# EasyEDA schematic SCH_catvalve.json
TITLE: valve; REV: 1.0; Date: 2024-05-08; Sheet: 1/1; Drawn By: yinsu0_o; Company: Yinsu
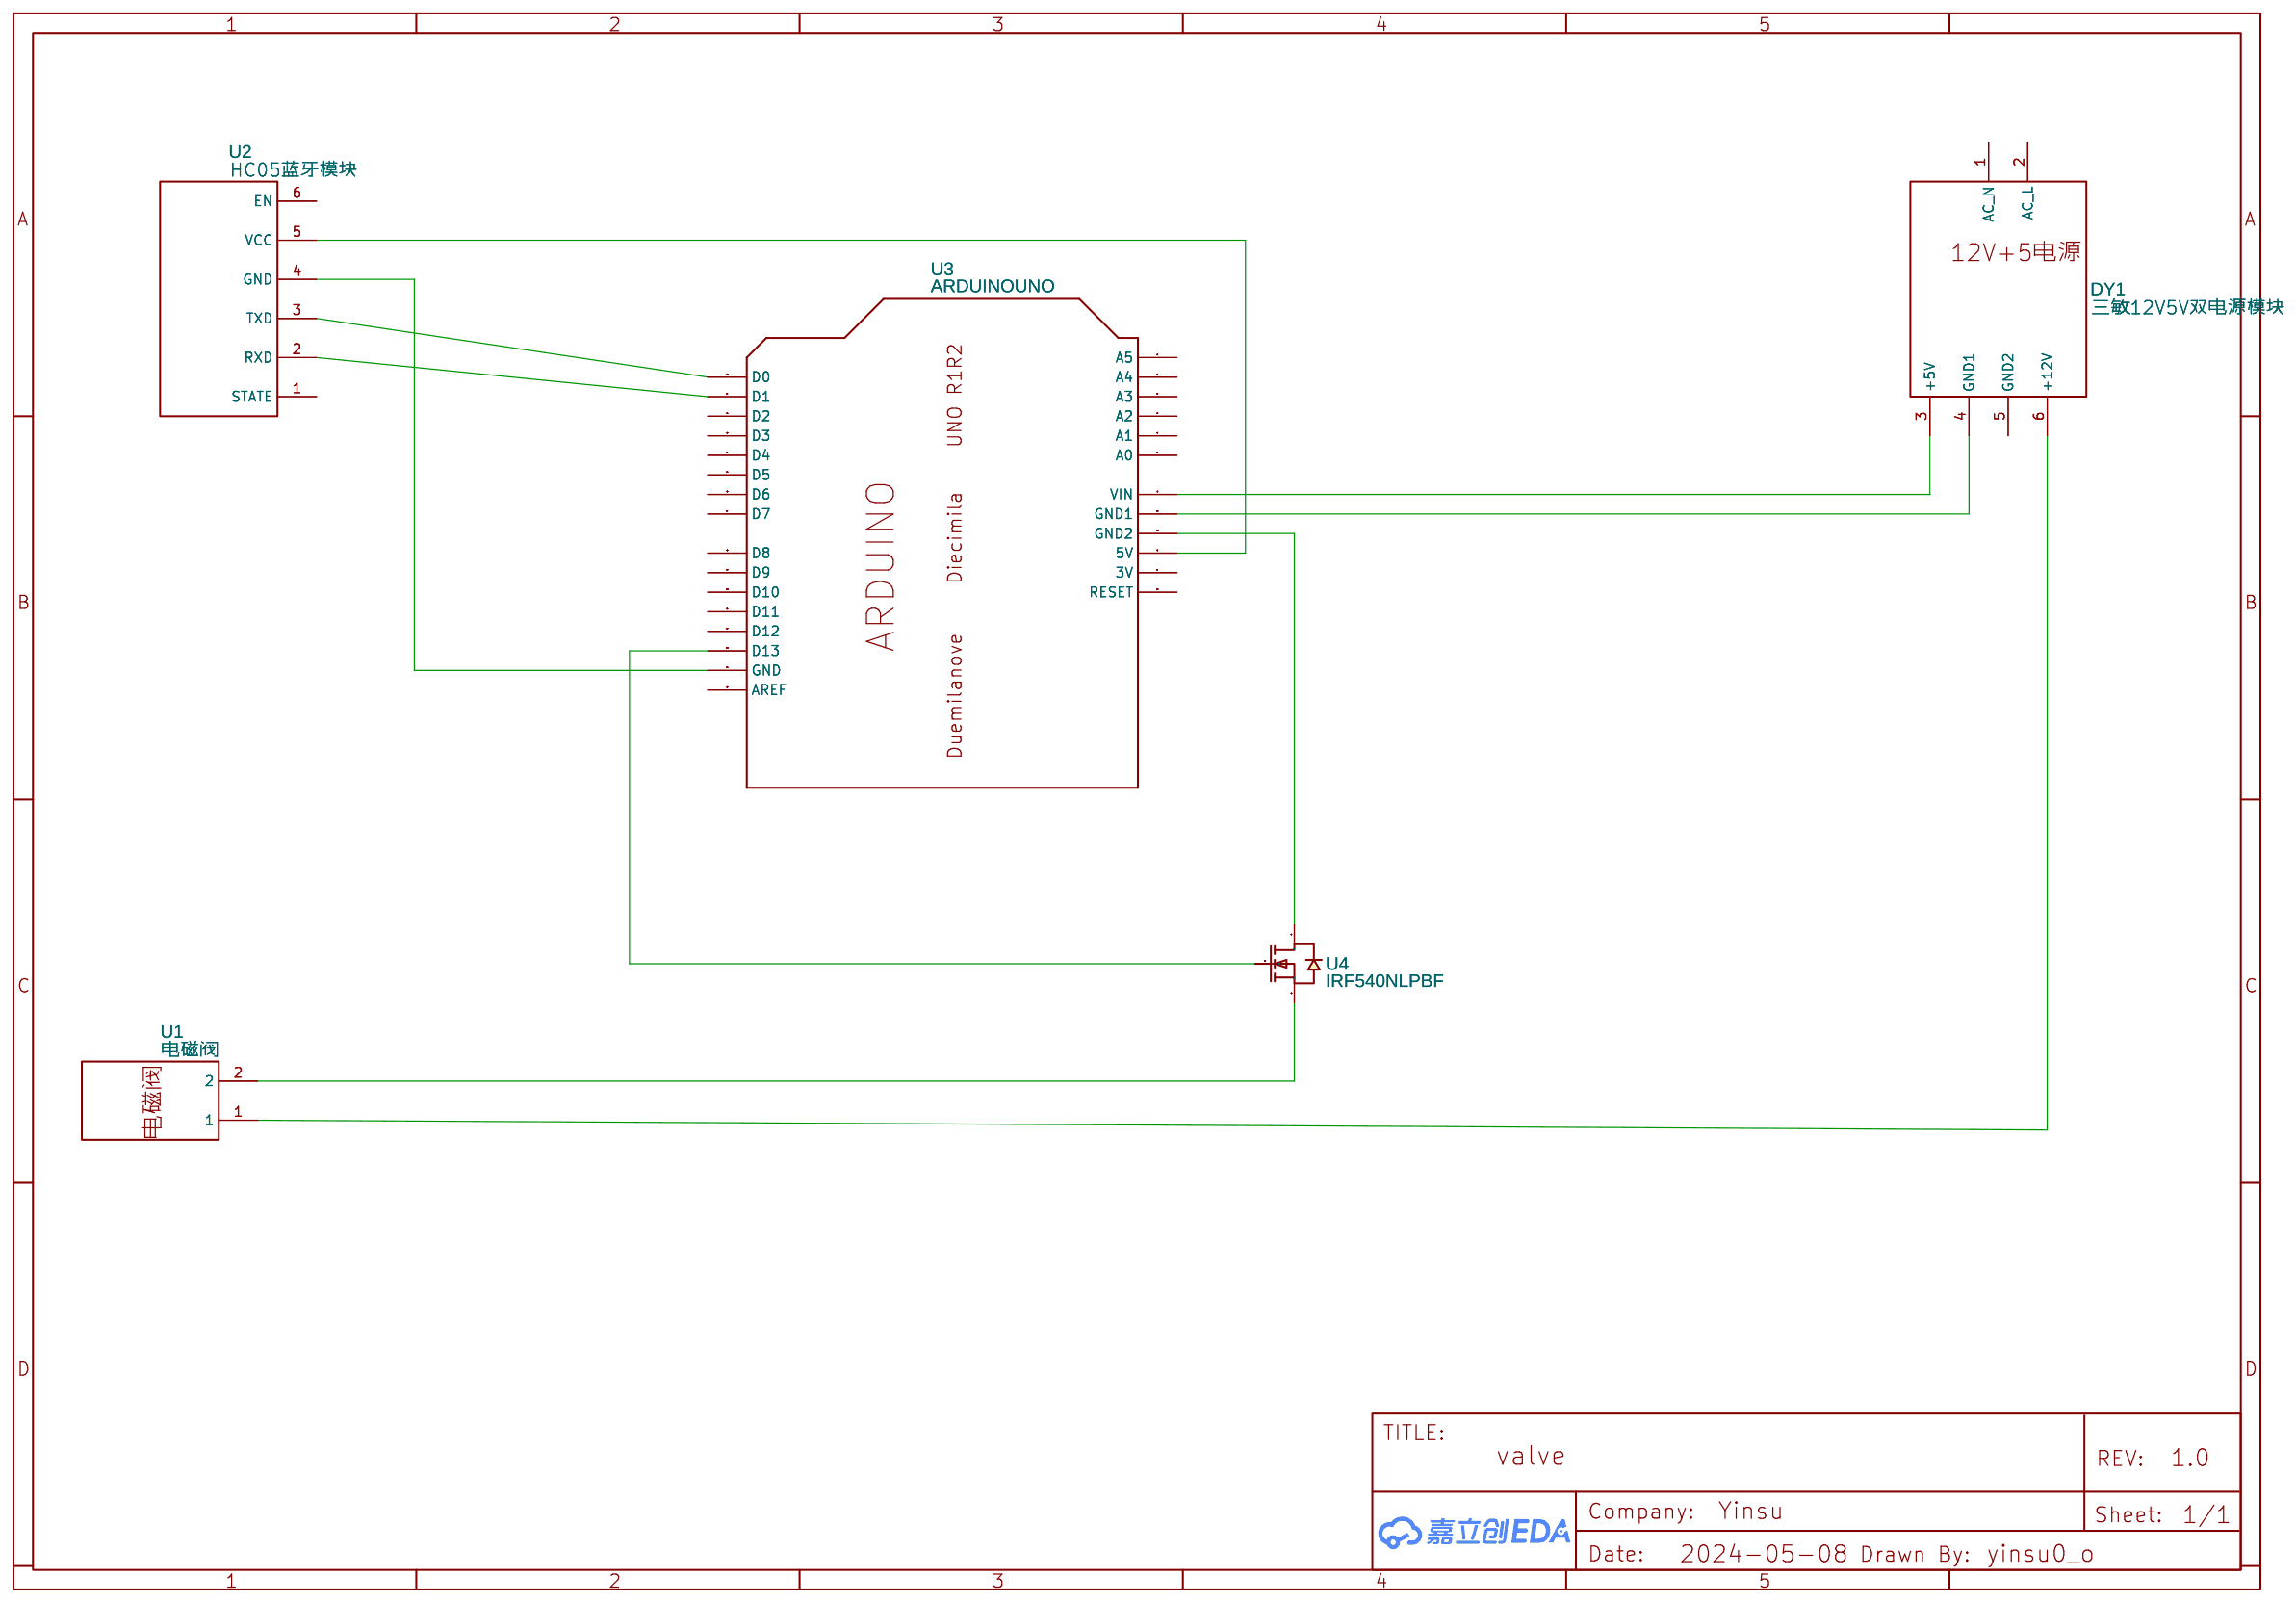
[diagram p0: schematic sheet]

## Parts
DY1  三敏12V5V双电源模块  [三敏12V5V双输出电源]
U1  电磁阀  [电磁阀]
U2  HC05蓝牙模块  [HC05]
U3  ARDUINOUNO  [ARDUINO]
U4  IRF540NLPBF  [TO-262-3_L10.2-W4.6-P2.54-L]

## Library data of the parts
DY1 = 三敏12V5V双电源模块: Contributor: zhaoji
U1 = 电磁阀
U2 = HC05: Contributor: h1253879361
U3 = ARDUINOUNO: Arduino DiecimilaDuemilanove; Contributor: yangdingding
U4 = IRF540NLPBF: Contributor: lcsc; Supplier: LCSC; Supplier Part: C459969; Manufacturer: Infineon(英飞凌); JLCPCB Part Class: Extended Part

## Nets
Net-(DY1-3): DY1.3(+5V) U3.VIN
Net-(DY1-4): DY1.4(GND1) U3.GND1
Net-(DY1-6): DY1.6(+12V) U1.1
Net-(U1-2): U1.2 U4.3(S)
Net-(U2-2): U2.2(RXD) U3.D1
Net-(U2-3): U2.3(TXD) U3.D0
Net-(U2-4): U2.4(GND) U3.GND
Net-(U2-5): U2.5(VCC) U3.5V
Net-(U3-D13): U3.D13 U4.1(G)
Net-(U3-GND2): U3.GND2 U4.2(D)

Not connected (* = marked no-connect by the designer): DY1 1(AC N) 2(AC L) 5(GND2); U2 1(STATE) 6(EN); U3 3V A0 A1 A2 A3 A4 A5 AREF D2 D3 D4 D5 D6 D7 D8 D9 D10 D11 D12 RESET
